# Altium schematic sheet LED_Driver - 4.SchDoc
size A3
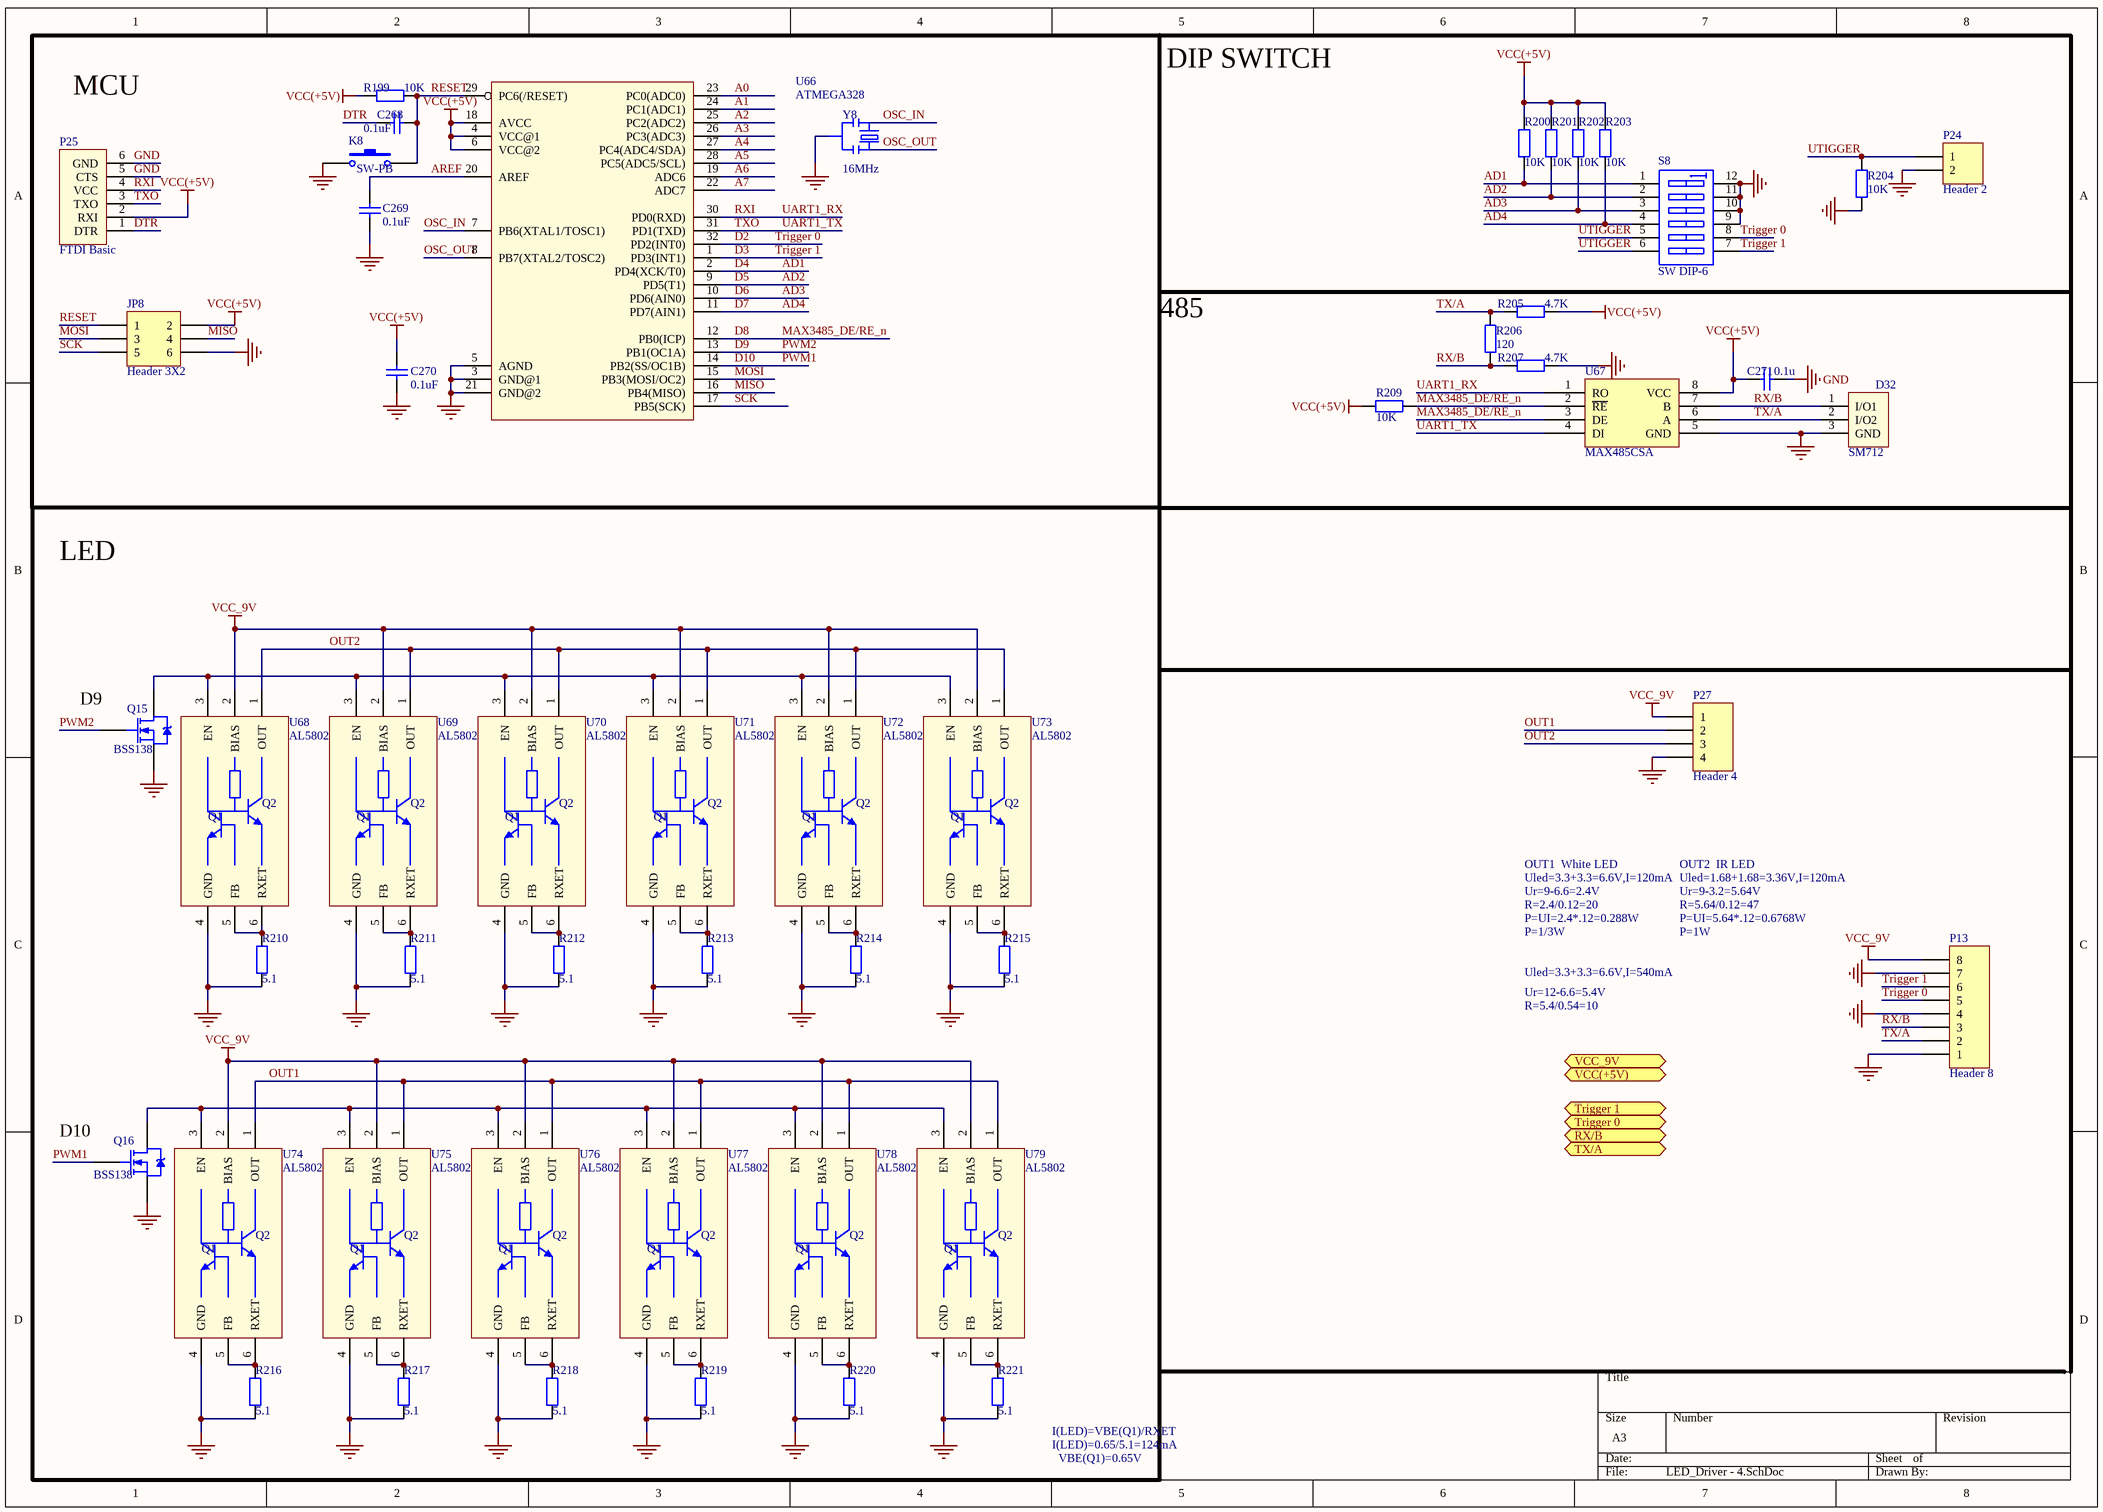
[diagram p0: LED_Driver - 4.SchDoc]

## Parts
C268  0.1uF  [C0603]
C269  0.1uF  [C0603]
C270  0.1uF  [C0603]
C271  0.1u  [C0603]
D32  SM712  [SOT23-3]
JP8  Header 3X2  [MHDR1X6]
K8  SW-PB  [157SW]
P13  Header 8  [SH_1.25MM*8]
P24  Header 2  [HDR1X2]
P25  FTDI Basic  [MHDR1X6]
P27  Header 4  [SMT_1.25MM*4]
Q15  BSS138  [SOT-23 (Standard)]
Q16  BSS138  [SOT-23 (Standard)]
R199  10K  [R0603]
R200  10K  [R0603]
R201  10K  [R0603]
R202  10K  [R0603]
R203  10K  [R0603]
R204  10K  [R0603]
R205  4.7K  [R0603]
R206  120  [R0603]
R207  4.7K  [R0603]
R209  10K  [R0603]
R210  5.1  [R0603]
R211  5.1  [R0603]
R212  5.1  [R0603]
R213  5.1  [R0603]
R214  5.1  [R0603]
R215  5.1  [R0603]
R216  5.1  [R0603]
R217  5.1  [R0603]
R218  5.1  [R0603]
R219  5.1  [R0603]
R220  5.1  [R0603]
R221  5.1  [R0603]
S8  SW DIP-6  [DIP_SW_6WAY_SMD]
U66  ATMEGA328  [TQFP32-08]
U67  MAX485CSA  [SOIC-8]
U68  AL5802  [SOT26]
U69  AL5802  [SOT26]
U70  AL5802  [SOT26]
U71  AL5802  [SOT26]
U72  AL5802  [SOT26]
U73  AL5802  [SOT26]
U74  AL5802  [SOT26]
U75  AL5802  [SOT26]
U76  AL5802  [SOT26]
U77  AL5802  [SOT26]
U78  AL5802  [SOT26]
U79  AL5802  [SOT26]
Y8  16MHz  [RESONATOR-SMD]

## Blocks framed on the sheet
LED: Q15 Q16 R210-R221 U68-U79

## Ports
RX/B (bidir), Trigger 0 (bidir), Trigger 1 (bidir), TX/A (bidir), VCC(+5V) (in), VCC_9V (bidir)

## Nets
GND: C269.1 C270.2 C271.1 D32.3(GND) JP8.6 K8.1 P13.1 P13.4 P13.7 P24.2 P25.5(CTS) P25.6(GND) P27.4 Q15.S Q16.S R204.1 R207.1 R210.2 R211.2 R212.2 R213.2 R214.2 R215.2 R216.2 R217.2 R218.2 R219.2 R220.2 R221.2 S8.9(B4) S8.10(B3) S8.11(B2) S8.12(B1) U66.3(GND@1) U66.5(AGND) U66.21(GND@2) U67.5(GND) U68.4(GND) U69.4(GND) U70.4(GND) U71.4(GND) U72.4(GND) U73.4(GND) U74.4(GND) U75.4(GND) U76.4(GND) U77.4(GND) U78.4(GND) U79.4(GND) Y8.2
VCC(+5V): C270.1 C271.2 JP8.2 P25.2(RXI) R199.1 R200.1 R201.1 R202.1 R203.1 R205.1 R209.2 U66.4(VCC@1) U66.6(VCC@2) U66.18(AVCC) U67.8(VCC)
VCC_9V: P13.8 P27.1 U68.2(BIAS) U69.2(BIAS) U70.2(BIAS) U71.2(BIAS) U72.2(BIAS) U73.2(BIAS) U74.2(BIAS) U75.2(BIAS) U76.2(BIAS) U77.2(BIAS) U78.2(BIAS) U79.2(BIAS)
A0: U66.23(PC0(ADC0))
A1: U66.24(PC1(ADC1))
A2: U66.25(PC2(ADC2))
A3: U66.26(PC3(ADC3))
A4: U66.27(PC4(ADC4/SDA))
A5: U66.28(PC5(ADC5/SCL))
A6: U66.19(ADC6)
A7: U66.22(ADC7)
AD1: R200.2 S8.1(A1) U66.2(PD4(XCK/T0))  [also labelled D4]
AD2: R201.2 S8.2(A2) U66.9(PD5(T1))  [also labelled D5]
AD3: R202.2 S8.3(A3) U66.10(PD6(AIN0))  [also labelled D6]
AD4: R203.2 S8.4(A4) U66.11(PD7(AIN1))  [also labelled D7]
AREF: C269.2 U66.20(AREF)
D2: P13.5 S8.8(B5) U66.32(PD2(INT0))  [also labelled Trigger 0]
D3: P13.6 S8.7(B6) U66.1(PD3(INT1))  [also labelled Trigger 1]
D8: R209.1 U66.12(PB0(ICP)) U67.2(~{RE}) U67.3(DE)  [also labelled MAX3485_DE/RE_n]
D9: Q15.G U66.13(PB1(OC1A))  [also labelled PWM2]
D10: Q16.G U66.14(PB2(SS/OC1B))  [also labelled PWM1]
DTR: C268.1 P25.1(DTR)
MISO: JP8.4 U66.16(PB4(MISO))
MOSI: JP8.3 U66.15(PB3(MOSI/OC2))
OSC_IN: U66.7(PB6(XTAL1/TOSC1)) Y8.3
OSC_OUT: U66.8(PB7(XTAL2/TOSC2)) Y8.1
OUT1: P27.2 U74.1(OUT) U75.1(OUT) U76.1(OUT) U77.1(OUT) U78.1(OUT) U79.1(OUT)
OUT2: P27.3 U68.1(OUT) U69.1(OUT) U70.1(OUT) U71.1(OUT) U72.1(OUT) U73.1(OUT)
RESET: C268.2 JP8.1 K8.2 R199.2 U66.29(PC6(/RESET))
RX/B: D32.1(I/O1) P13.3 R206.2 R207.2 U67.7(B)
RXI: P25.4(VCC) U66.30(PD0(RXD)) U67.1(RO)  [also labelled UART1_RX]
SCK: JP8.5 U66.17(PB5(SCK))
TX/A: D32.2(I/O2) P13.2 R205.2 R206.1 U67.6(A)
TXO: P25.3(TXO) U66.31(PD1(TXD)) U67.4(DI)  [also labelled UART1_TX]
UTIGGER: P24.1 R204.2 S8.5(A5) S8.6(A6)
NetQ15_D: Q15.D U68.3(EN) U69.3(EN) U70.3(EN) U71.3(EN) U72.3(EN) U73.3(EN)
NetQ16_D: Q16.D U74.3(EN) U75.3(EN) U76.3(EN) U77.3(EN) U78.3(EN) U79.3(EN)
NetR210_1: R210.1 U68.5(FB) U68.6(RXET)
NetR211_1: R211.1 U69.5(FB) U69.6(RXET)
NetR212_1: R212.1 U70.5(FB) U70.6(RXET)
NetR213_1: R213.1 U71.5(FB) U71.6(RXET)
NetR214_1: R214.1 U72.5(FB) U72.6(RXET)
NetR215_1: R215.1 U73.5(FB) U73.6(RXET)
NetR216_1: R216.1 U74.5(FB) U74.6(RXET)
NetR217_1: R217.1 U75.5(FB) U75.6(RXET)
NetR218_1: R218.1 U76.5(FB) U76.6(RXET)
NetR219_1: R219.1 U77.5(FB) U77.6(RXET)
NetR220_1: R220.1 U78.5(FB) U78.6(RXET)
NetR221_1: R221.1 U79.5(FB) U79.6(RXET)

## Notes on the sheet
- MCU
- DIP SWITCH
- 485
- (near Q15) D9
- Uled=3.3+3.3=6.6V,I=120mA
- OUT1  White LED
- R=2.4/0.12=20
- P=UI=2.4*.12=0.288W
- Ur=9-6.6=2.4V
- Uled=1.68+1.68=3.36V,I=120mA
- OUT2  IR LED
- R=5.64/0.12=47
- P=UI=5.64*.12=0.6768W
- Ur=9-3.2=5.64V
- P=1/3W
- Uled=3.3+3.3=6.6V,I=540mA
- Ur=12-6.6=5.4V
- P=1W
- R=5.4/0.54=10
- (near Q16) D10
- I(LED)=VBE(Q1)/RXET
- I(LED)=0.65/5.1=124mA
- VBE(Q1)=0.65V
- (in symbol AL5802) Q2; Q1

## Library data of the parts
C268-C270 = CAP SMT C100nF25V10%X7R: Capacitor; Voltage: 25V; iPartNumber: C100nF25V10%X7R; Value: 0.1uF
C271 = Cap: Capacitor; Value: 100pF; Published: 8-Jun-2000; LatestRevisionDate: 17-Jul-2002; LatestRevisionNote: Re-released for DXP Platform.; PackageReference: RAD-0.3; Publisher: Altium Limited
JP8 = Header 3X2: Header, 3-Pin, Dual row; LatestRevisionDate: 17-Jul-2002; LatestRevisionNote: Re-released for DXP Platform.; Publisher: Altium Limited
K8 = SW-PB: Switch; Published: 24-Mar-1999; LatestRevisionDate: 17-Jul-2002; LatestRevisionNote: Re-released for DXP Platform.; PackageReference: SPST-2; Publisher: Altium Limited; PackageDescription: Switch; 2 Leads
P13 = Header 8: Header, 8-Pin; LatestRevisionDate: 17-Jul-2002; LatestRevisionNote: Re-released for DXP Platform.; Publisher: Altium Limited
P24 = Header 2: Header, 2-Pin; LatestRevisionDate: 17-Jul-2002; LatestRevisionNote: Re-released for DXP Platform.; Publisher: Altium Limited
P25 = ARDUINO_SERIAL_PROGRAMPTH
P27 = Header 4: Header, 4-Pin; LatestRevisionDate: 17-Jul-2002; LatestRevisionNote: Re-released for DXP Platform.; Publisher: Altium Limited
Q15 Q16 = NMOS: Manufacturer: Fairchild Semiconductor; Manufacturer Part Number: BSS123; FET Type: MOSFET N-Channel, Metal Oxide; FET Feature: Logic Level Gate; Drain to Source Voltage (Vdss): 100V; Current - Continuous Drain (Id) @ 25°C: 170mA (Ta); Rds On (Max) @ Id, Vgs: 6 Ohm @ 170mA, 10V; Vgs(th) (Max) @ Id: 2V @ 1mA; Gate Charge (Qg) @ Vgs: 2.5nC @ 10V; Input Capacitance (Ciss) @ Vds: 73pF @ 25V; Power - Max: 360mW; Supplier 1: Digi-Key; Supplier Part Number 1: BSS123NCT-ND; RoHS: RoHS Compliant; Category: Discrete Semiconductor Products; Stock 1: 163946; Pricing 1: 1=0.24, 10=0.216, 25=0.1556, 100=0.1211, 250=0.07612, 500=0.06484, 1000=0.04418 (USD); Packaging: Cut Tape (CT); Mounting Type: Surface Mount; Package / Case: TO-236-3, SC-59, SOT-23-3; Supplier Device Package: SOT-23; ComponentLink1URL: http://www.fairchildsemi.com/datasheets/BS/BSS123.pdf; ComponentLink1Description: http://www.fairchildsemi.com/datasheets/BS/BSS123.pdf
R199-R203 R205-R207 R209-R221 = Res2: Resistor
R204 = Res2: Resistor; Value: 1k; Published: 8-Jun-2000; LatestRevisionDate: 17-Jul-2002; LatestRevisionNote: Re-released for DXP Platform.; PackageReference: AXIAL-0.4; Publisher: Altium Limited
S8 = SW DIP-6: DIP Switch, 6 Position, SPST; Published: 24-Mar-1999; LatestRevisionDate: 17-Jul-2002; LatestRevisionNote: Re-released for DXP Platform.; PackageReference: DIP-12/SW; Publisher: Altium Limited
U66 = ATMEGA168
U67 = MAX3485CSA
Y8 = RESONATORSMD